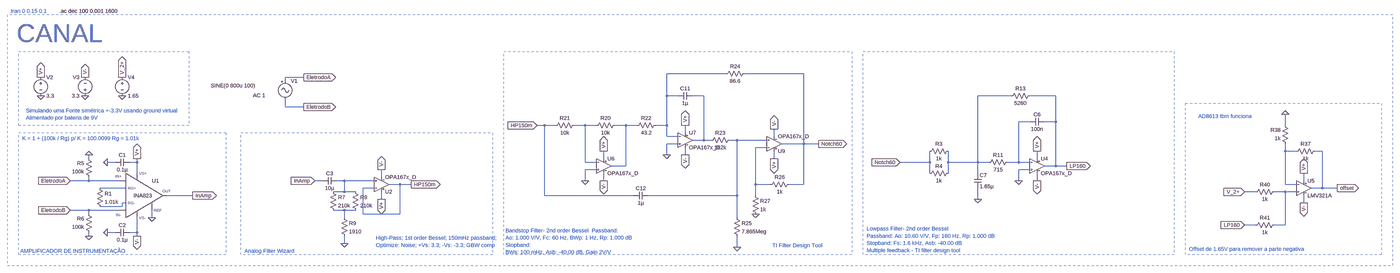
[diagram p0: schematic canal.asc, whole sheet]
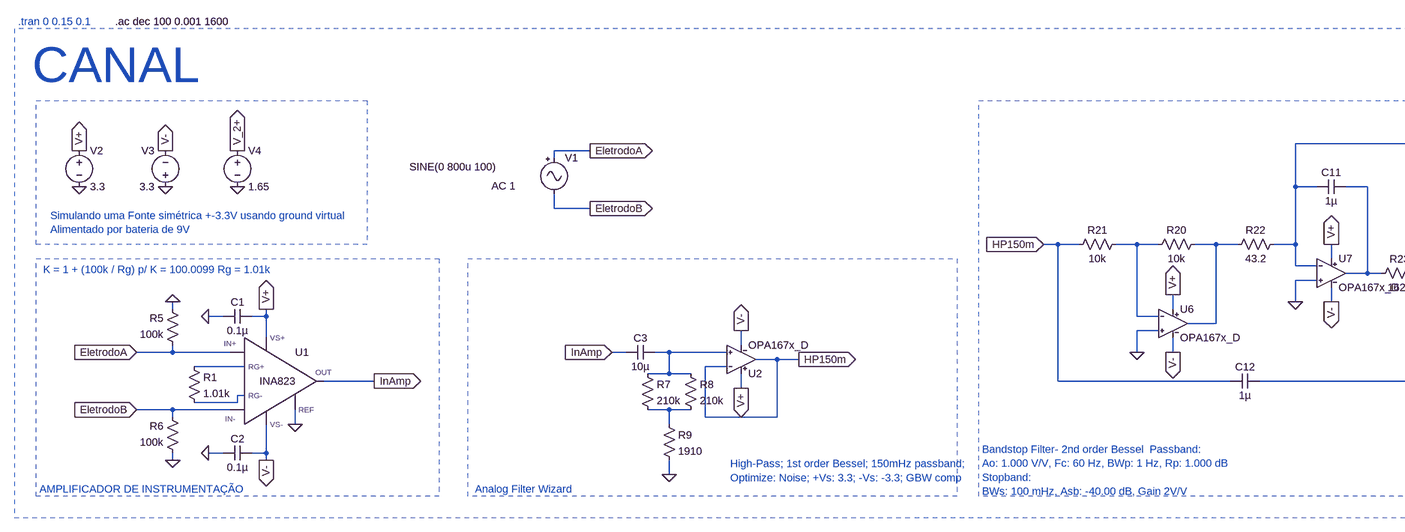
[diagram p1: schematic canal.asc, part, row 1 of 1, column 1 of 2]
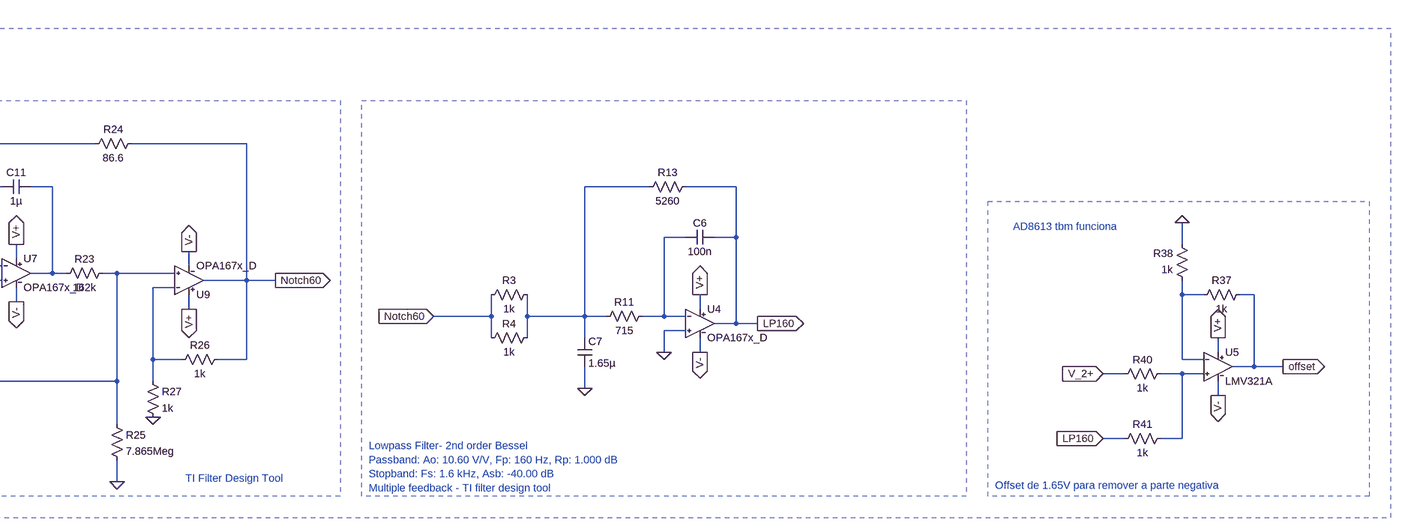
[diagram p2: schematic canal.asc, part, row 1 of 1, column 2 of 2]
canal.asc, the LTspice schematic file:
Version 4.1
SHEET 1 6804 2324
WIRE 2160 -176 1904 -176
WIRE 2496 -176 2240 -176
WIRE 336 -160 256 -160
WIRE 256 -144 256 -160
WIRE 1904 -80 1904 -176
WIRE 1952 -80 1904 -80
WIRE 2064 -80 2016 -80
WIRE 3392 -80 3248 -80
WIRE 3584 -80 3472 -80
WIRE 256 -32 256 -64
WIRE 336 -32 256 -32
WIRE 3472 32 3424 32
WIRE 3584 32 3584 -80
WIRE 3584 32 3536 32
WIRE 1376 48 1344 48
WIRE 1424 48 1376 48
WIRE 1552 48 1504 48
WIRE 1600 48 1552 48
WIRE 1728 48 1680 48
WIRE 1776 48 1728 48
WIRE 1904 48 1904 -80
WIRE 1904 48 1856 48
WIRE 4576 48 4576 0
WIRE 1984 80 1984 48
WIRE 1904 96 1904 48
WIRE 1952 96 1904 96
WIRE 2368 96 2368 64
WIRE 2064 112 2064 -80
WIRE 2064 112 2016 112
WIRE 2096 112 2064 112
WIRE 2208 112 2176 112
WIRE 2336 112 2208 112
WIRE 1952 128 1904 128
WIRE 2496 128 2496 -176
WIRE 2496 128 2400 128
WIRE 2560 128 2496 128
WIRE 2336 144 2288 144
WIRE 4576 160 4576 128
WIRE 4624 160 4576 160
WIRE 4736 160 4704 160
WIRE 1904 176 1904 128
WIRE 1984 176 1984 144
WIRE -592 192 -592 176
WIRE 1632 192 1632 160
WIRE 2368 192 2368 160
WIRE 3504 192 3504 160
WIRE -480 208 -512 208
WIRE -384 208 -384 192
WIRE -384 208 -416 208
WIRE 1552 208 1552 48
WIRE 1600 208 1552 208
WIRE 3040 208 3040 160
WIRE 3040 208 2912 208
WIRE 3120 208 3120 160
WIRE 3248 208 3248 -80
WIRE 3248 208 3120 208
WIRE 3296 208 3248 208
WIRE 3424 208 3424 32
WIRE 3424 208 3376 208
WIRE 3472 208 3424 208
WIRE 1728 224 1728 48
WIRE 1728 224 1664 224
WIRE 3584 224 3584 32
WIRE 3584 224 3536 224
WIRE 3632 224 3584 224
WIRE 1600 240 1552 240
WIRE 3472 240 3424 240
WIRE -384 256 -384 208
WIRE 3040 256 3040 208
WIRE 3120 256 3120 208
WIRE 3248 256 3248 208
WIRE 672 272 672 240
WIRE -592 288 -592 272
WIRE -592 288 -672 288
WIRE -464 288 -592 288
WIRE 416 288 384 288
WIRE 512 288 480 288
WIRE 640 288 512 288
WIRE 1552 288 1552 240
WIRE 1632 288 1632 256
WIRE 3424 288 3424 240
WIRE 3504 288 3504 256
WIRE 4656 288 4656 256
WIRE 752 304 704 304
WIRE 800 304 752 304
WIRE 2288 304 2288 144
WIRE 2352 304 2288 304
WIRE 2496 304 2496 128
WIRE 2496 304 2432 304
WIRE 4576 304 4576 160
WIRE 4624 304 4576 304
WIRE -432 320 -544 320
WIRE 640 320 592 320
WIRE 4736 320 4736 160
WIRE 4736 320 4688 320
WIRE 4800 320 4736 320
WIRE 512 336 512 288
WIRE 512 336 464 336
WIRE 560 336 512 336
WIRE 4448 336 4400 336
WIRE 4576 336 4528 336
WIRE 4624 336 4576 336
WIRE -144 352 -256 352
WIRE 1376 352 1376 48
WIRE 1760 352 1376 352
WIRE 2208 352 2208 112
WIRE 2208 352 1824 352
WIRE 2288 352 2288 304
WIRE 672 368 672 336
WIRE 3248 368 3248 320
WIRE -432 384 -448 384
WIRE 4656 384 4656 352
WIRE -448 400 -448 384
WIRE -448 400 -544 400
WIRE -592 416 -672 416
WIRE -464 416 -592 416
WIRE 512 416 464 416
WIRE 560 416 512 416
WIRE -592 432 -592 416
WIRE 592 432 592 320
WIRE 752 432 752 304
WIRE 752 432 592 432
WIRE -320 448 -320 416
WIRE 512 448 512 416
WIRE 2208 448 2208 352
WIRE 4448 480 4400 480
WIRE 4576 480 4576 336
WIRE 4576 480 4528 480
WIRE -480 512 -512 512
WIRE -384 512 -384 448
WIRE -384 512 -416 512
WIRE -592 528 -592 512
WIRE -384 528 -384 512
WIRE 512 560 512 528
WIRE 2208 576 2208 528
FLAG -672 288 EletrodoA
IOPIN -672 288 In
FLAG -672 416 EletrodoB
IOPIN -672 416 In
FLAG -144 352 InAmp
IOPIN -144 352 Out
FLAG -384 528 V-
IOPIN -384 528 Out
FLAG -384 192 V+
IOPIN -384 192 Out
FLAG -320 448 0
FLAG -512 208 0
FLAG -512 512 0
FLAG 672 368 V+
IOPIN 672 368 Out
FLAG 672 240 V-
IOPIN 672 240 Out
FLAG 384 288 InAmp
IOPIN 384 288 In
FLAG 800 304 HP150m
IOPIN 800 304 Out
FLAG 336 -160 EletrodoA
IOPIN 336 -160 Out
FLAG 1552 288 0
FLAG 1632 160 V+
IOPIN 1632 160 Out
FLAG 1632 288 V-
IOPIN 1632 288 Out
FLAG 1984 48 V+
IOPIN 1984 48 Out
FLAG 1984 176 V-
IOPIN 1984 176 Out
FLAG 1904 176 0
FLAG 1344 48 HP150m
IOPIN 1344 48 In
FLAG 2368 192 V+
IOPIN 2368 192 Out
FLAG 2368 64 V-
IOPIN 2368 64 Out
FLAG 2208 576 0
FLAG 2560 128 Notch60
IOPIN 2560 128 Out
FLAG 2288 432 0
FLAG 3504 160 V+
IOPIN 3504 160 Out
FLAG 3504 288 V-
IOPIN 3504 288 Out
FLAG 3248 368 0
FLAG 2912 208 Notch60
IOPIN 2912 208 In
FLAG 3424 288 0
FLAG 3632 224 LP160
IOPIN 3632 224 Out
FLAG 4656 384 V-
IOPIN 4656 384 Out
FLAG 4656 256 V+
IOPIN 4656 256 Out
FLAG 4400 480 LP160
IOPIN 4400 480 In
FLAG 4576 0 0
FLAG 4800 320 offset
IOPIN 4800 320 Out
FLAG -608 -160 V-
IOPIN -608 -160 Out
FLAG 4400 336 V_2+
IOPIN 4400 336 In
FLAG -800 -160 V+
IOPIN -800 -160 Out
FLAG -448 -160 V_2+
IOPIN -448 -160 Out
FLAG 336 -32 EletrodoB
IOPIN 336 -32 Out
FLAG -800 -80 0
FLAG -608 -80 0
FLAG -448 -80 0
FLAG -592 528 0
FLAG -592 176 0
FLAG 512 560 0
SYMBOL INA823 -368 352 R0
SYMATTR InstName U1
SYMBOL cap -416 192 R90
WINDOW 0 0 32 VBottom 2
WINDOW 3 32 32 VTop 2
SYMATTR InstName C1
SYMATTR Value 0.1µ
SYMBOL cap -416 496 R90
WINDOW 0 0 32 VBottom 2
WINDOW 3 32 32 VTop 2
SYMATTR InstName C2
SYMATTR Value 0.1µ
SYMBOL res -560 304 R0
SYMATTR InstName R1
SYMATTR Value 1.01k
SYMBOL Misc\\signal 256 -160 R0
WINDOW 3 -322 36 Left 2
WINDOW 123 -139 78 Left 2
WINDOW 39 0 0 Left 0
SYMATTR Value SINE(0 800u 100)
SYMATTR Value2 AC 1
SYMATTR InstName V1
SYMBOL cap 480 272 R90
WINDOW 0 0 32 VBottom 2
WINDOW 3 32 32 VTop 2
SYMATTR InstName C3
SYMATTR Value 10µ
SYMBOL res 1696 32 R90
WINDOW 0 0 56 VBottom 2
WINDOW 3 32 56 VTop 2
SYMATTR InstName R20
SYMATTR Value 10k
SYMBOL res 1520 32 R90
WINDOW 0 0 56 VBottom 2
WINDOW 3 32 56 VTop 2
SYMATTR InstName R21
SYMATTR Value 10k
SYMBOL res 1872 32 R90
WINDOW 0 0 56 VBottom 2
WINDOW 3 32 56 VTop 2
SYMATTR InstName R22
SYMATTR Value 43.2
SYMBOL cap 2016 -96 R90
WINDOW 0 0 32 VBottom 2
WINDOW 3 32 32 VTop 2
SYMATTR InstName C11
SYMATTR Value 1µ
SYMBOL res 2192 96 R90
WINDOW 0 0 56 VBottom 2
WINDOW 3 32 56 VTop 2
SYMATTR InstName R23
SYMATTR Value 162k
SYMBOL cap 1824 336 R90
WINDOW 0 0 32 VBottom 2
WINDOW 3 32 32 VTop 2
SYMATTR InstName C12
SYMATTR Value 1µ
SYMBOL res 2256 -192 R90
WINDOW 0 0 56 VBottom 2
WINDOW 3 32 56 VTop 2
SYMATTR InstName R24
SYMATTR Value 86.6
SYMBOL res 2192 432 R0
SYMATTR InstName R25
SYMATTR Value 7.865Meg
SYMBOL res 2448 288 R90
WINDOW 0 0 56 VBottom 2
WINDOW 3 32 56 VTop 2
SYMATTR InstName R26
SYMATTR Value 1k
SYMBOL res 2272 336 R0
SYMATTR InstName R27
SYMATTR Value 1k
SYMBOL cap 3536 16 R90
WINDOW 0 0 32 VBottom 2
WINDOW 3 32 32 VTop 2
SYMATTR InstName C6
SYMATTR Value 100n
SYMBOL res 3392 192 R90
WINDOW 0 0 56 VBottom 2
WINDOW 3 32 56 VTop 2
SYMATTR InstName R11
SYMATTR Value 715
SYMBOL cap 3232 256 R0
SYMATTR InstName C7
SYMATTR Value 1.65µ
SYMBOL res 3488 -96 R90
WINDOW 0 0 56 VBottom 2
WINDOW 3 32 56 VTop 2
SYMATTR InstName R13
SYMATTR Value 5260
SYMBOL res 4544 320 R90
WINDOW 0 0 56 VBottom 2
WINDOW 3 32 56 VTop 2
SYMATTR InstName R40
SYMATTR Value 1k
SYMBOL res 4544 464 R90
WINDOW 0 0 56 VBottom 2
WINDOW 3 32 56 VTop 2
SYMATTR InstName R41
SYMATTR Value 1k
SYMBOL res 4720 144 R90
WINDOW 0 0 56 VBottom 2
WINDOW 3 32 56 VTop 2
SYMATTR InstName R37
SYMATTR Value 1k
SYMBOL res 4592 144 R180
WINDOW 0 36 76 Left 2
WINDOW 3 36 40 Left 2
SYMATTR InstName R38
SYMATTR Value 1k
SYMBOL OPA167x_D 672 368 M180
SYMATTR InstName U2
SYMBOL OPA167x_D 1632 160 R0
SYMATTR InstName U6
SYMBOL OPA167x_D 1984 48 R0
SYMATTR InstName U7
SYMBOL OPA167x_D 2368 192 M180
SYMATTR InstName U9
SYMBOL OPA167x_D 3504 160 R0
SYMATTR InstName U4
SYMBOL voltage -800 -176 R0
WINDOW 123 0 0 Left 0
WINDOW 39 0 0 Left 0
SYMATTR InstName V2
SYMATTR Value 3.3
SYMBOL voltage -608 -64 R180
WINDOW 0 24 96 Left 2
WINDOW 3 24 16 Left 2
WINDOW 123 0 0 Left 0
WINDOW 39 0 0 Left 0
SYMATTR InstName V3
SYMATTR Value 3.3
SYMBOL voltage -448 -176 R0
WINDOW 123 0 0 Left 0
WINDOW 39 0 0 Left 0
SYMATTR InstName V4
SYMATTR Value 1.65
SYMBOL res -576 288 R180
WINDOW 0 36 76 Left 2
WINDOW 3 36 40 Left 2
SYMATTR InstName R5
SYMATTR Value 100k
SYMBOL res -576 528 R180
WINDOW 0 36 76 Left 2
WINDOW 3 36 40 Left 2
SYMATTR InstName R6
SYMATTR Value 100k
SYMBOL lmv321a 4656 256 R0
SYMATTR InstName U5
SYMBOL res 3136 144 R90
WINDOW 0 0 56 VBottom 2
WINDOW 3 32 56 VTop 2
SYMATTR InstName R3
SYMATTR Value 1k
SYMBOL res 3136 240 R90
WINDOW 0 0 56 VBottom 2
WINDOW 3 32 56 VTop 2
SYMATTR InstName R4
SYMATTR Value 1k
SYMBOL res 448 320 R0
SYMATTR InstName R7
SYMATTR Value 210k
SYMBOL res 544 320 R0
SYMATTR InstName R8
SYMATTR Value 210k
SYMBOL res 496 432 R0
SYMATTR InstName R9
SYMATTR Value 1910
TEXT -880 104 Left 2 ;K = 1 + (100k / Rg) p/ K = 100.0099 Rg = 1.01k
TEXT -888 592 Left 2 ;AMPLIFICADOR DE INSTRUMENTAÇÃO
TEXT -720 -448 Left 2 !.ac dec 100 0.001 1600
TEXT 648 536 Left 2 ;High-Pass; 1st order Bessel; 150mHz passband; \nOptimize: Noise; +Vs: 3.3; -Vs: -3.3; GBW comp
TEXT 80 592 Left 2 ;Analog Filter Wizard
TEXT 1208 504 Left 2 ;Bandstop Filter- 2nd order Bessel  Passband:\nAo: 1.000 V/V, Fc: 60 Hz, BWp: 1 Hz, Rp: 1.000 dB\nStopband:\nBWs: 100 mHz, Asb: -40.00 dB, Gain 2V/V
TEXT 2360 568 Left 2 ;TI Filter Design Tool
TEXT 2768 496 Left 2 ;Lowpass Filter- 2nd order Bessel\nPassband: Ao: 10.60 V/V, Fp: 160 Hz, Rp: 1.000 dB\nStopband: Fs: 1.6 kHz, Asb: -40.00 dB\nMultiple feedback - TI filter design tool
TEXT 4160 584 Left 2 ;Offset de 1.65V para remover a parte negativa
TEXT -864 -16 Left 2 ;Simulando uma Fonte simétrica +-3.3V usando ground virtual\nAlimentado por bateria de 9V
TEXT -904 -352 Left 7 ;CANAL
TEXT -936 -448 Left 2 ;.tran 0 0.15 0.1
TEXT 4200 8 Left 2 ;AD8613 tbm funciona
RECTANGLE Normal 0 608 -896 80 2
RECTANGLE Normal 1152 608 64 80 2
RECTANGLE Normal 2704 608 1200 -272 2
RECTANGLE Normal 4096 608 2752 -272 2
RECTANGLE Normal 4992 608 4144 -48 2
RECTANGLE Normal -944 656 5040 -432 2
RECTANGLE Normal -160 48 -896 -272 2

The netlist it stands for:
* canal.asc
X§U1 EletrodoA EletrodoB V+ V- InAmp 0 N011 N013 INA823  ; pins IN+ IN- VS+ VS- OUT REF RG+ RG-
C1 V+ 0 0.1µ
C2 V- 0 0.1µ
R1 N011 N013 1.01k
V1 EletrodoA EletrodoB SINE(0 800u 100) AC 1
C3 N010 InAmp 10µ
R20 N006 N005 10k
R21 N005 HP150m 10k
R22 N001 N006 43.2
C11 N002 N001 1µ
R23 N007 N002 162k
C12 N007 HP150m 1µ
R24 Notch60 N001 86.6
R25 N007 0 7.865Meg
R26 Notch60 N008 1k
R27 N008 0 1k
C6 LP160 N004 100n
R11 N004 N003 715
C7 N003 0 1.65µ
R13 LP160 N003 5260
R40 N012 V_2+ 1k
R41 N012 LP160 1k
R37 offset N009 1k
R38 N009 0 1k
X§U2 N010 HP150m V+ V- HP150m OPA167x_D  ; pins IN+ IN- VCC VEE OUT
X§U6 0 N005 V+ V- N006 OPA167x_D  ; pins IN+ IN- VCC VEE OUT
X§U7 0 N001 V+ V- N002 OPA167x_D  ; pins IN+ IN- VCC VEE OUT
X§U9 N007 N008 V+ V- Notch60 OPA167x_D  ; pins IN+ IN- VCC VEE OUT
X§U4 0 N004 V+ V- LP160 OPA167x_D  ; pins IN+ IN- VCC VEE OUT
V2 V+ 0 3.3
V3 0 V- 3.3
V4 V_2+ 0 1.65
R5 EletrodoA 0 100k
R6 0 EletrodoB 100k
X§U5 N012 N009 V+ V- offset LMV321A  ; pins IN+ IN- VCC VEE OUT
R3 N003 Notch60 1k
R4 N003 Notch60 1k
R7 N010 N014 210k
R8 N010 N014 210k
R9 N014 0 1910
* K = 1 + (100k / Rg) p/ K = 100.0099 Rg = 1.01k
* AMPLIFICADOR DE INSTRUMENTAÇÃO
.ac dec 100 0.001 1600
* High-Pass; 1st order Bessel; 150mHz passband;
* Optimize: Noise; +Vs: 3.3; -Vs: -3.3; GBW comp
* Analog Filter Wizard
* Bandstop Filter- 2nd order Bessel  Passband:
* Ao: 1.000 V/V, Fc: 60 Hz, BWp: 1 Hz, Rp: 1.000 dB
* Stopband:
* BWs: 100 mHz, Asb: -40.00 dB, Gain 2V/V
* TI Filter Design Tool
* Lowpass Filter- 2nd order Bessel
* Passband: Ao: 10.60 V/V, Fp: 160 Hz, Rp: 1.000 dB
* Stopband: Fs: 1.6 kHz, Asb: -40.00 dB
* Multiple feedback - TI filter design tool
* Offset de 1.65V para remover a parte negativa
* Simulando uma Fonte simétrica +-3.3V usando ground virtual
* Alimentado por bateria de 9V
* CANAL
* .tran 0 0.15 0.1
* AD8613 tbm funciona
.lib INA823.sub
.lib OPA167x_D.lib
.lib lmv321a.lib
.backanno
.end